# Altium schematic sheet BATTERY.SchDoc
size A4
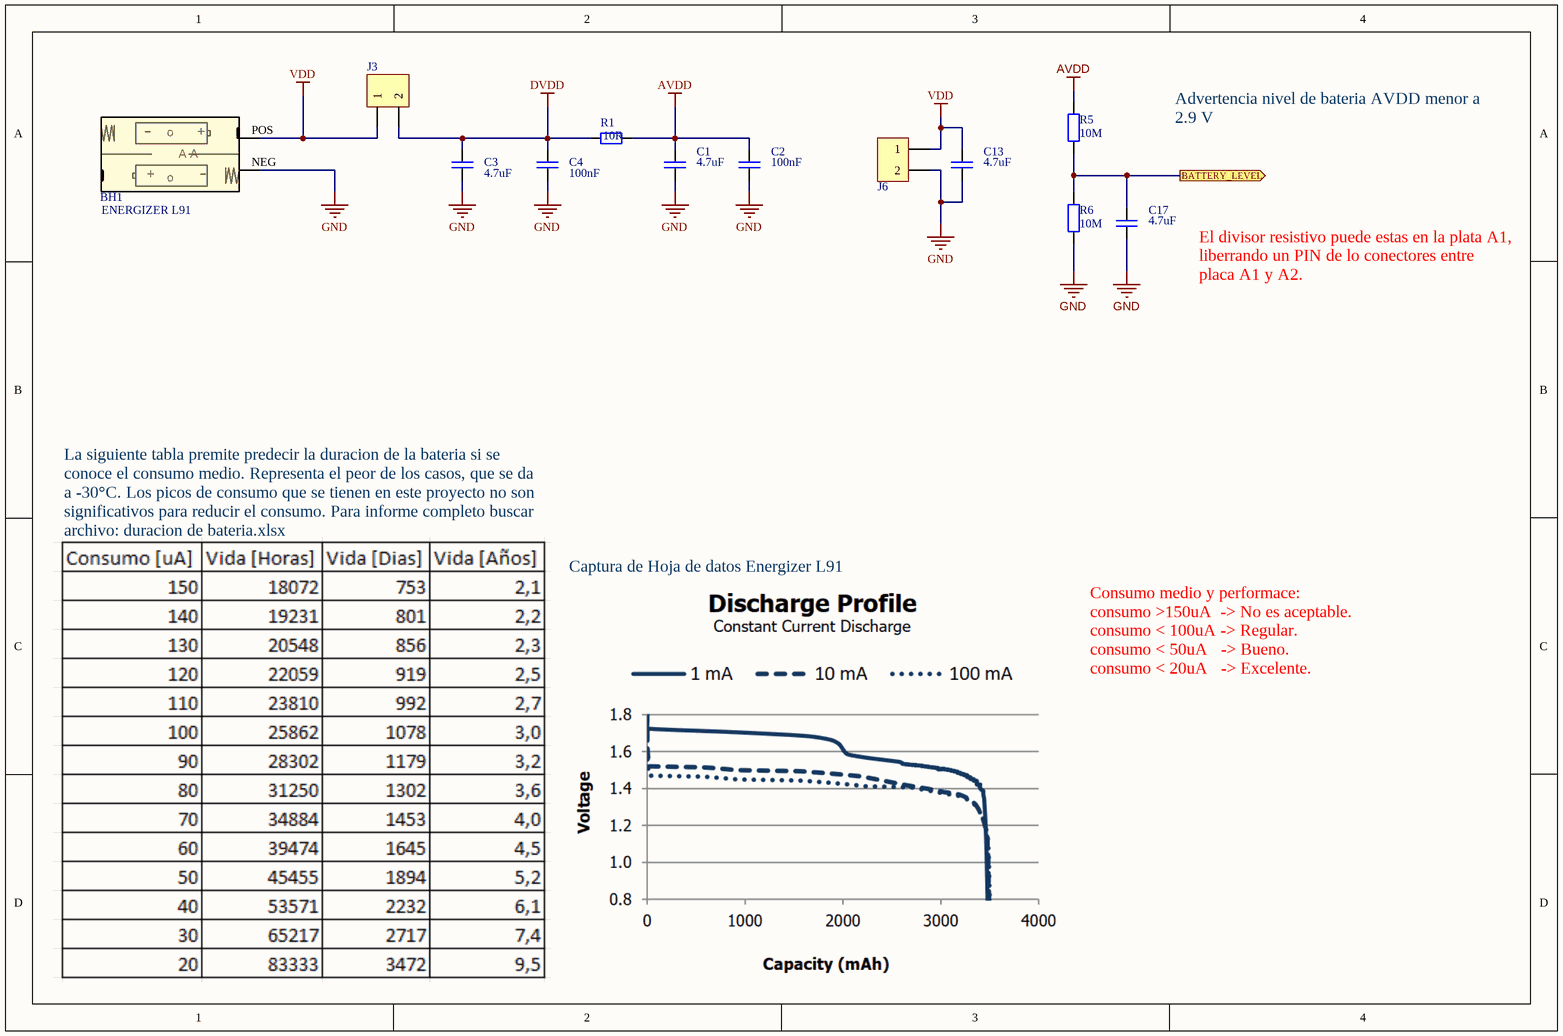
[diagram p0: BATTERY.SchDoc]

## Parts
BH1  ENERGIZER L91  [BATTERY_HOLDER_2XAA]
C1  4.7uF  [CAP_SM0805_YAGEOCC2_N]
C2  100nF  [CAP_SM0805_YAGEOCC2_N]
C3  4.7uF  [CAP_SM0805_YAGEOCC2_N]
C4  100nF  [CAP_SM0805_YAGEOCC2_N]
C13  4.7uF  [CAP_SM0805_YAGEOCC2_N]
C17  4.7uF  [CAP_SM0805_YAGEOCC2_N]
J3  Usar Equivalente  [HEADER PIN 1X2]  (value not drawn)
J6  Usar Equivalente  [HEADER PIN 1X2]  (value not drawn)
R1  10R  [RES_SM0805_YAGEORC_N]
R5  10M  [RES_SM0805_YAGEORC_N]
R6  10M  [RES_SM0805_YAGEORC_N]

## Ports
BATTERY_LEVEL (out)

## Nets
AVDD: C1.1 C2.1 R1.2 R5.2
DVDD: C3.1 C4.1 J3.2 R1.1
GND: BH1.NEG C1.2 C2.2 C3.2 C4.2 C13.2 C17.2 J6.2 R6.1
VDD: BH1.POS C13.1 J3.1 J6.1
BATTERY_LEVEL: C17.1 R5.1 R6.2 ; port BATTERY_LEVEL

## Notes on the sheet
- Advertencia nivel de bateria AVDD menor a 2.9 V
- El divisor resistivo puede estas en la plata A1, liberrando un PIN de lo conectores entre  placa A1 y A2.
- La siguiente tabla premite predecir la duracion de la bateria si se conoce el consumo medio. Representa el peor de los casos, que se da a -30°C. Los picos de consumo que se tienen en este proyecto no son significativos para reducir el consumo. Para informe completo buscar archivo: duracion de bateria.xlsx
- Captura de Hoja de datos Energizer L91
- Consumo medio y performace:
  consumo >150uA  -> No es aceptable.
  consumo < 100uA -> Regular.
  consumo < 50uA   -> Bueno.
  consumo < 20uA   -> Excelente.
- Title:
- Size: A4
- Date:
- FMC-320U MODEL A
- Sheet:
- Time:
- Of:
- Version:
- Revision:
- Release:
- 1
- 0
- FLOWMEET SRL
- File
- (in symbol 2462) +; A A

## Library data of the parts
BH1 = 2462: 2 x AA through hole economic type; Manufacturer: Keystone; Manufacturer Part Number: 2462; Category: Battery holder; Datasheet: https://www.keyelco.com/userAssets/file/M65p28.pdf; Temperature Max: -; Temperature Min: -
C1 C3 C13 C17 = CC0805KRX5R6BB475: CAP 4.7uF SM0805 X5R 10V YAGEO CC2; Tolerance (%): 10; Category: Capacitor; Manufacturer: Yageo; Manufacturer Part Number: CC0805KRX5R6BB475; Package: 0805; Value: 4.7uF; Supplier Part Number 1: 718671; Supplier 1: Farnell; ComponentLink1URL: http://www.yageo.com; ComponentLink1Description: Manufacturer Website; Voltage Rating (Volts): 10; Supplier 2: Digi-Key; Supplier Part Number 2: 311-1374-1-ND; Datasheet: https://datasheet.lcsc.com/lcsc/2304140030_YAGEO-CC0805KRX5R6BB475_C605218.pdf
C2 C4 = CC0805KRX7R8BB104: CAP 100nF SM0805 X7R 25V YAGEO CC2; Tolerance (%): 10; Voltage Rating (Volts): 25; Category: Capacitor; Manufacturer: Yageo; Manufacturer Part Number: CC0805KRX7R8BB104; Package: 0805; Value: 100nF; Supplier Part Number 1: 644249; Supplier 1: Farnell; ComponentLink1URL: http://www.yageo.com; ComponentLink1Description: Manufacturer Website; Supplier 2: Digi-Key; Supplier Part Number 2: 311-1141-1-ND; Datasheet: https://datasheet.lcsc.com/lcsc/2006111832_YAGEO-CC0805KRX7R8BB104_C519981.pdf
J3 J6 = 54101-T0602LF: 1 x 2 - true hole  2.54mm - Pb free; Manufacturer: Amphenol ICC; Equivalente: B-2100S02P-A110; Manufacturer Part Number: 54101-T0602LF; Category: Header pin; Datasheet: https://datasheet.lcsc.com/lcsc/2202082130_Amphenol-ICC-54101-T06-00_C213463.pdf; Temperature Max: 125; Temperature Min: -65
R1 = RC0805FR-0710RL: RES 10R SM0805 YAGEO RC_L; Power (Watts): 0.125; Resistance (Ohms): 10; Tolerance (%): 1; Category: Resistor; Manufacturer: Yageo; Manufacturer Part Number: RC0805FR-0710RL; Package: 0805; Value: 10R; Supplier Part Number 1: 9237240; Supplier 1: Farnell; ComponentLink1Description: Manufacturer Website; ComponentLink1URL: http://www.yageo.com; Supplier 2: Digi-Key; Supplier Part Number 2: 311-10.0CRCT-ND; Datasheet: https://www.yageo.com/upload/media/product/app/datasheet/rchip/pyu-rc_group_51_rohs_l.pdf
R5 R6 = RC0805FR-0710ML: RES 10M SM0805 YAGEO RC_L; Power (Watts): 0.125; Resistance (Ohms): 10000000; Tolerance (%): 1; Category: Resistor; Manufacturer: Yageo; Manufacturer Part Number: RC0805FR-0710ML; Package: 0805; Value: 10M; Supplier Part Number 1: 9238115; Supplier 1: Farnell; ComponentLink1URL: http://www.yageo.com; ComponentLink1Description: Manufacturer Website; Supplier 2: Digi-Key; Supplier Part Number 2: 311-10.0MCRCT-ND